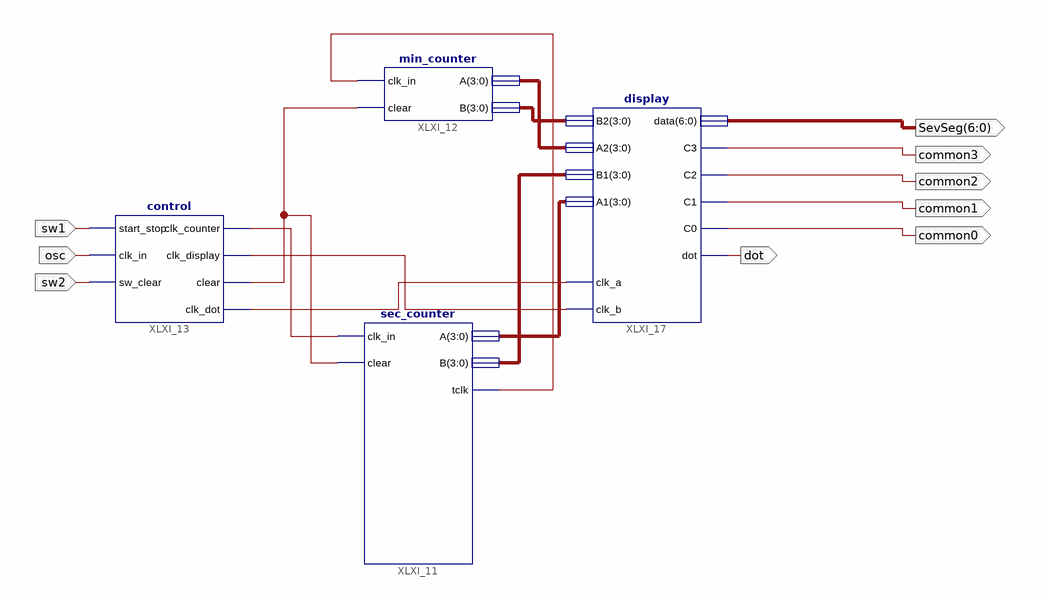
[diagram p0: schematic sheet 1]
// Xilinx ISE schematic main.sch (spartan6) as structural Verilog: 4 symbols, 9 ports
module main (
  input  osc,
  input  sw1,
  input  sw2,
  output [6:0] SevSeg,
  output common3,
  output common2,
  output common1,
  output common0,
  output dot
);

  wire XLXN_29, XLXN_37, XLXN_40, XLXN_41, XLXN_42;
  wire [3:0] XLXN_23, XLXN_24, XLXN_27, XLXN_28;

  sec_counter XLXI_11 (.clk_in(XLXN_41), .clear(XLXN_29), .A(XLXN_24), .B(XLXN_23), .tclk(XLXN_37));
  min_counter XLXI_12 (.clk_in(XLXN_37), .clear(XLXN_29), .A(XLXN_27), .B(XLXN_28));
  control XLXI_13 (
    .start_stop(sw1), .clk_in(osc), .sw_clear(sw2), .clk_counter(XLXN_41), .clk_display(XLXN_40),
    .clear(XLXN_29), .clk_dot(XLXN_42));
  display XLXI_17 (
    .B2(XLXN_28), .A2(XLXN_27), .B1(XLXN_23), .A1(XLXN_24), .clk_b(XLXN_40), .clk_a(XLXN_42), .data(SevSeg),
    .C0(common0), .C2(common2), .C3(common3), .C1(common1), .dot(dot));
endmodule
